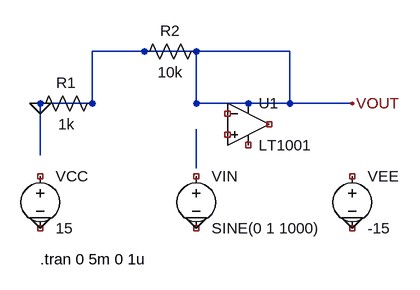
[diagram p0: schematic 03_circuit_generated-by-claude-sonnet-4-6.asc]
03_circuit_generated-by-claude-sonnet-4-6.asc, the LTspice schematic file:
Version 4
SHEET 1 880 680
WIRE 160 320 240 320
WIRE 240 320 240 240
WIRE 240 240 400 240
WIRE 400 240 400 320
WIRE 400 320 544 320
WIRE 544 320 544 240
WIRE 544 240 400 240
WIRE 400 320 640 320
WIRE 160 320 160 400
WIRE 400 360 400 400
WIRE 400 400 400 420
SYMBOL res 256 304 R90
WINDOW 0 0 56 VBottom 2
WINDOW 3 32 56 VTop 2
SYMATTR InstName R1
SYMATTR Value 1k
SYMBOL res 416 224 R90
WINDOW 0 0 56 VBottom 2
WINDOW 3 32 56 VTop 2
SYMATTR InstName R2
SYMATTR Value 10k
SYMBOL Opamps\opamp2 480 288 R0
SYMATTR InstName U1
SYMATTR Value LT1001
SYMBOL voltage 400 416 R0
WINDOW 123 0 0 Left 0
WINDOW 39 0 0 Left 0
SYMATTR InstName VIN
SYMATTR Value SINE(0 1 1000)
SYMBOL voltage 160 416 R0
WINDOW 123 0 0 Left 0
WINDOW 39 0 0 Left 0
SYMATTR InstName VCC
SYMATTR Value 15
SYMBOL voltage 640 416 R0
WINDOW 123 0 0 Left 0
WINDOW 39 0 0 Left 0
SYMATTR InstName VEE
SYMATTR Value -15
FLAG 160 496 0
FLAG 400 496 0
FLAG 640 496 0
FLAG 640 320 VOUT
FLAG 160 320 0
TEXT 160 560 Left 2 !.tran 0 5m 0 1u

The netlist it stands for:
* 03_circuit_generated-by-claude-sonnet-4-6.asc
R1 0 0 1k
R2 0 0 10k
XU1 NC_01 NC_02 0 NC_03 NC_04 LT1001  ; pins In+ In- V+ V- OUT
VIN NC_05 NC_06 SINE(0 1 1000)
VCC NC_07 NC_08 15
VEE NC_09 NC_10 -15
.tran 0 5m 0 1u
.backanno
.end